# EAGLE design picusb (EAGLE 6.5.0)
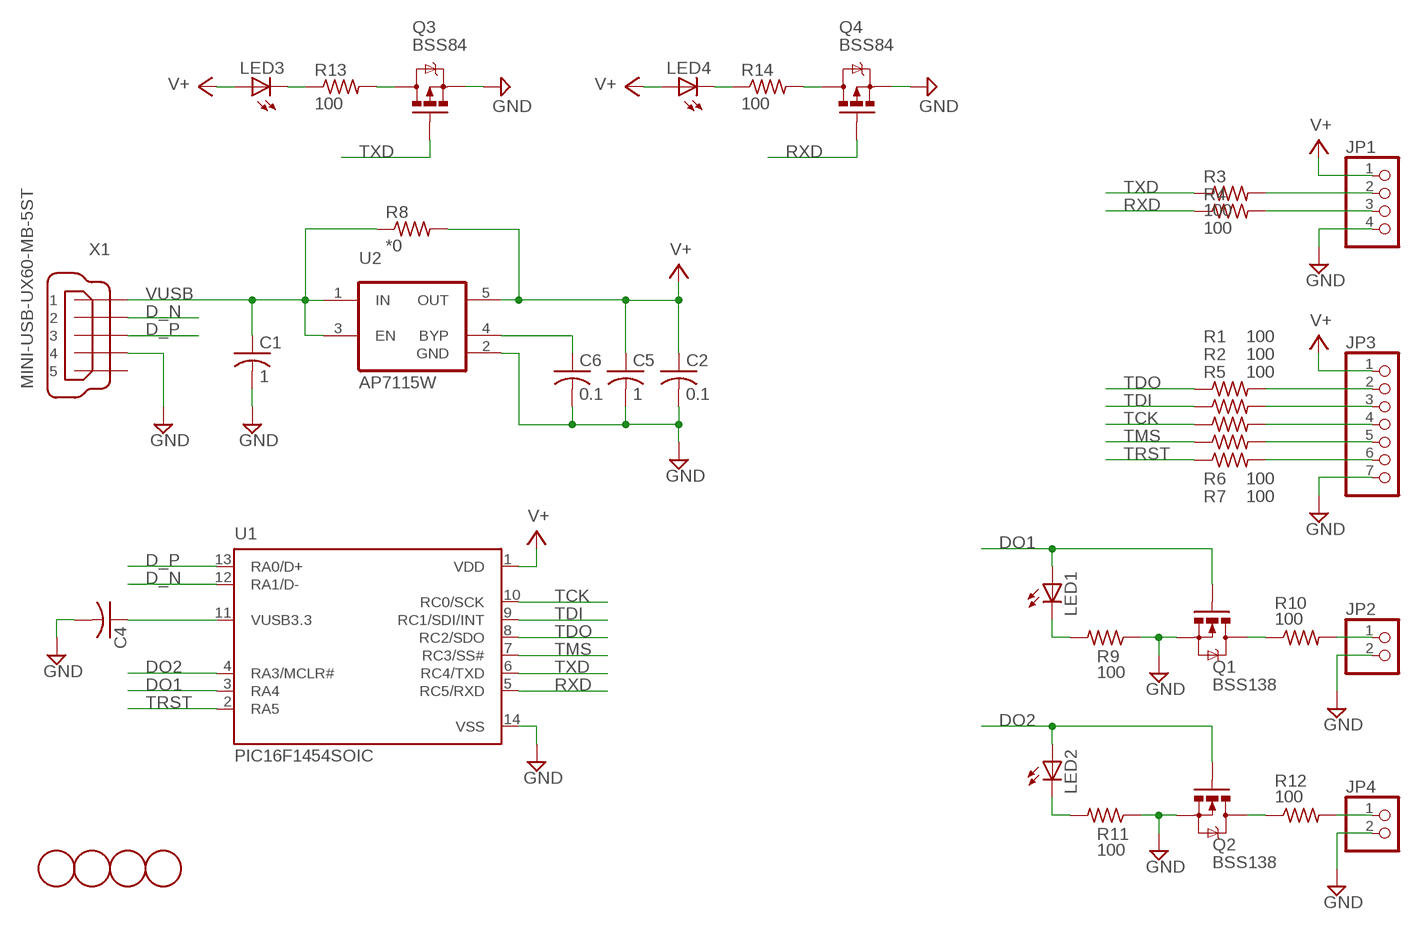
[diagram p0: schematic, sheet 1]

## Parts
C1  1  C-USC0805  [C0805]
C2  0.1  C-USC0805  [C0805]
C4  C-USC0805  [C0805]
C5  1  C-USC0805  [C0805]
C6  0.1  C-USC0805  [C0805]
JP1  PINHD-1X4  [1X04]
JP2  PINHD-1X2  [1X02]
JP3  PINHD-1X7  [1X07]
JP4  PINHD-1X2  [1X02]
LED1  LEDCHIP-LED0805  [CHIP-LED0805]
LED2  LEDCHIP-LED0805  [CHIP-LED0805]
LED3  LEDCHIP-LED0805  [CHIP-LED0805]
LED4  LEDCHIP-LED0805  [CHIP-LED0805]
Q1  BSS138  MOSFET-NCHANNELSMD  [SOT23-3]
Q2  BSS138  MOSFET-NCHANNELSMD  [SOT23-3]
Q3  BSS84  MOSFET-PCHANNELSOT23  [SOT23]
Q4  BSS84  MOSFET-PCHANNELSOT23  [SOT23]
R1  100  R-US_R0805  [R0805]
R2  100  R-US_R0805  [R0805]
R3  100  R-US_R0805  [R0805]
R4  100  R-US_R0805  [R0805]
R5  100  R-US_R0805  [R0805]
R6  100  R-US_R0805  [R0805]
R7  100  R-US_R0805  [R0805]
R8  *0  R-US_R0805  [R0805]
R9  100  R-US_R0805  [R0805]
R10  100  R-US_R0805  [R0805]
R11  100  R-US_R0805  [R0805]
R12  100  R-US_R0805  [R0805]
R13  100  R-US_R0805  [R0805]
R14  100  R-US_R0805  [R0805]
U1  PIC16F1454SOIC  [SOIC14]
U2  AP7115W  [SOT25]
U$1  MOUNTING_HOLENO_4  [HOLE_MTG_NO4]
U$2  MOUNTING_HOLENO_4  [HOLE_MTG_NO4]
U$3  MOUNTING_HOLENO_4  [HOLE_MTG_NO4]
U$4  MOUNTING_HOLENO_4  [HOLE_MTG_NO4]
X1  MINI-USB-UX60-MB-5ST  [UX60-MB-5ST]

## Nets
D_N: U1.12(RA1/D-) X1.2
D_P: U1.13(RA0/D+) X1.3
DO1: LED1.A Q1.1(G) U1.3(RA4)
DO2: LED2.A Q2.1(G) U1.4(RA3/MCLR#)
GND: C1.2 C2.2 C4.2 C5.2 C6.2 JP1.4 JP2.2 JP3.7 JP4.2 Q1.2(S) Q2.2(S) Q3.2(S) Q4.2(S) R9.1 R11.1 U1.14(VSS) U2.2(GND) X1.4
N$1: JP2.1 R10.2
N$2: C6.1 U2.4(BYP)
N$3: JP3.2 R1.2
N$4: C4.1 U1.11(VUSB3.3)
N$5: JP1.2 R3.2
N$6: JP1.3 R4.2
N$7: JP3.3 R2.2
N$8: LED1.C R9.2
N$9: JP3.4 R5.2
N$10: JP3.5 R6.2
N$11: JP3.6 R7.2
N$12: JP4.1 R12.2
N$13: Q1.3(D) R10.1
N$14: LED3.C R13.1
N$15: Q2.3(D) R12.1
N$16: Q3.3(D) R13.2
N$17: LED2.C R11.2
N$18: LED4.C R14.1
N$19: Q4.3(D) R14.2
RXD: Q4.1(G) R4.1 U1.5(RC5/RXD)
TCK: R5.1 U1.10(RC0/SCK)
TDI: R2.1 U1.9(RC1/SDI/INT)
TDO: R1.1 U1.8(RC2/SDO)
TMS: R6.1 U1.7(RC3/SS#)
TRST: R7.1 U1.2(RA5)
TXD: Q3.1(G) R3.1 U1.6(RC4/TXD)
V+: C2.1 C5.1 JP1.1 JP3.1 LED3.A LED4.A R8.2 U1.1(VDD) U2.5(OUT)
VUSB: C1.1 R8.1 U2.1(IN) U2.3(EN) X1.1
Unconnected: X1.5

## Library data of the parts
C1 C2 C4-C6 = rcl:C-US: CAPACITOR, American symbol
JP1 = pinhead:PINHD-1X4: PIN HEADER
JP2 JP4 = pinhead:PINHD-1X2: PIN HEADER
JP3 = pinhead:PINHD-1X7: PIN HEADER
LED1-LED4 = led:LED: LED OSRAM: - CHIPLED LG R971, LG N971, LY N971, LG Q971, LY Q971, LO R971, LY R971 LH N974, LH R974 LS Q976, LO Q976, LY Q976 LO Q996 - Hyper CHIPLED LW Q18S LB Q993, LB Q99A, LB R99A - SideLED LS A670, LO A670, LY A670, LG A670, LP A670 LB A673, LV A673, LT A673, LW A673 LH A674 LY A675 LS A676, LA A676, LO A676, LY A676, LW A676 LS A679, LY A679, LG A679 - Hyper Micro SIDELED® LS Y876, LA Y876, LO Y876, LY Y876 LT Y87S - SmartLED LW L88C, LW L88S LB L89C, LB L89S, LG L890 LS L89K, LO L89K, LY L89K LS L896, LA L896, LO L896, LY L896 - TOPLED LS T670, LO T670, LY T670, LG T670, LP T670 LSG T670, LSP T670, LSY T670, LOP T670, LYG T670 LG T671, LOG T671, LSG T671 LB T673, LV T673, LT T673, LW T673 LH T674 LS T676, LA T676, LO T676, LY T676, LB T676, LH T676, LSB T676, LW T676 LB T67C, LV T67C, LT T67C, LS T67K, LO T67K, LY T67K, LW E67C LS E67B, LA E67B, LO E67B, LY E67B, LB E67C, LV E67C, LT E67C LW T67C LS T679, LY T679, LG T679 LS T770, LO T770, LY T770, LG T770, LP T770 LB T773, LV T773, LT T773, LW T773 LH T774 LS E675, LA E675, LY E675, LS T675 LS T776, LA T776, LO T776, LY T776, LB T776 LHGB T686 LT T68C, LB T68C - Hyper Mini TOPLED® LB M676 - Mini TOPLED Santana® LG M470 LS M47K, LO M47K, LY M47K Source: http://www.osram.convergy.de LUXEON: - LUMILED® LXK2-PW12-R00, LXK2-PW12-S00, LXK2-PW14-U00, LXK2-PW14-V00 LXK2-PM12-R00, LXK2-PM12-S00, LXK2-PM14-U00 LXK2-PE12-Q00, LXK2-PE12-R00, LXK2-PE12-S00, LXK2-PE14-T00, LXK2-PE14-U00 LXK2-PB12-K00, LXK2-PB12-L00, LXK2-PB12-M00, LXK2-PB14-N00, LXK2-PB14-P00, LXK2-PB14-Q00 LXK2-PR12-L00, LXK2-PR12-M00, LXK2-PR14-Q00, LXK2-PR14-R00 LXK2-PD12-Q00, LXK2-PD12-R00, LXK2-PD12-S00 LXK2-PH12-R00, LXK2-PH12-S00 LXK2-PL12-P00, LXK2-PL12-Q00, LXK2-PL12-R00 Source: www.luxeon.com KINGBRIGHT: KA-3528ASYC Source: www.kingbright.com
Q1 Q2 = SparkFun:MOSFET-NCHANNEL
Q3 Q4 = SparkFun:MOSFET-PCHANNEL
R1-R14 = rcl:R-US_: RESISTOR, American symbol
U1 = microcontroller:PIC16F1454
U2 = ak-misc:AP7115
U$1-U$4 = ak-misc:MOUNTING_HOLE
X1 = con-hirose:MINI-USB-: MINI USB Connector Source: http://www.hirose.co.jp/cataloge_hp/e24000019.pdf; OC_FARNELL: unknown; OC_NEWARK: unknown

## Board
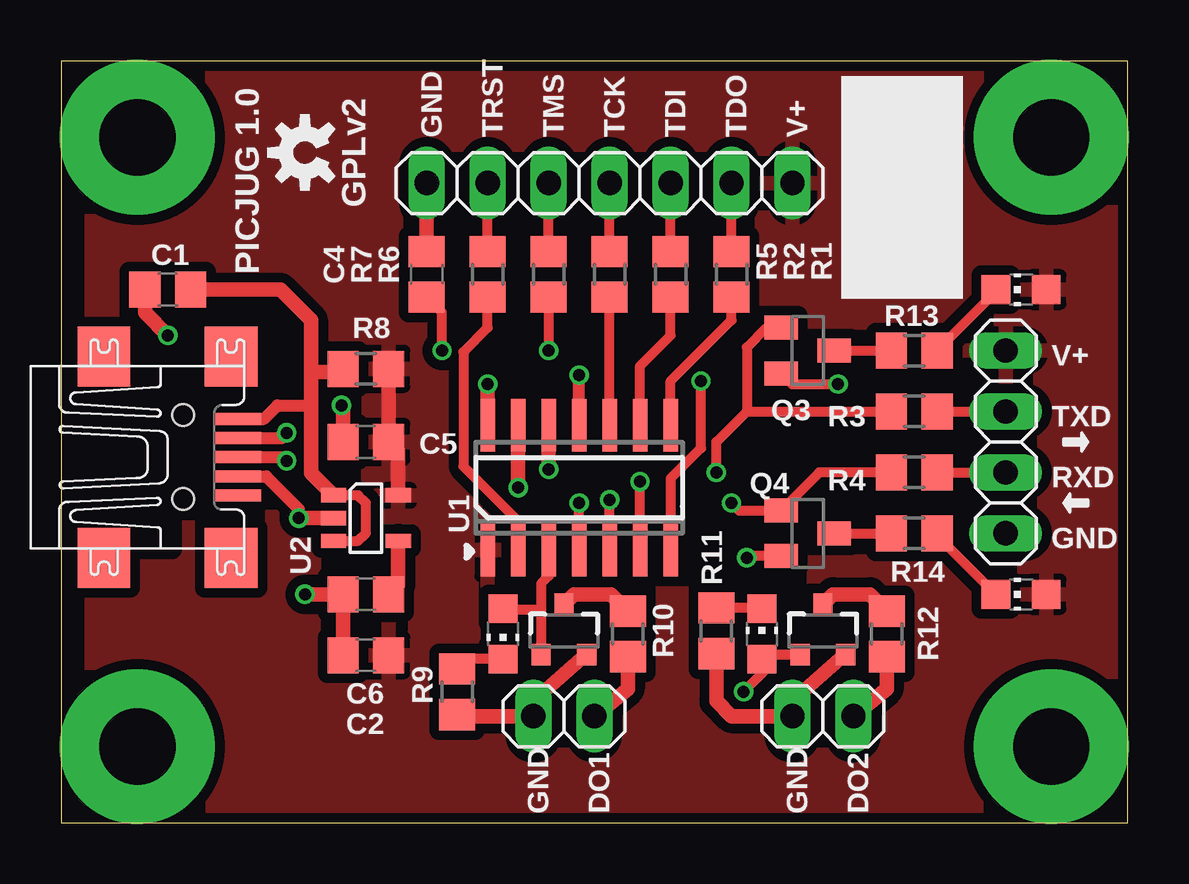
[diagram p1: board, top side]
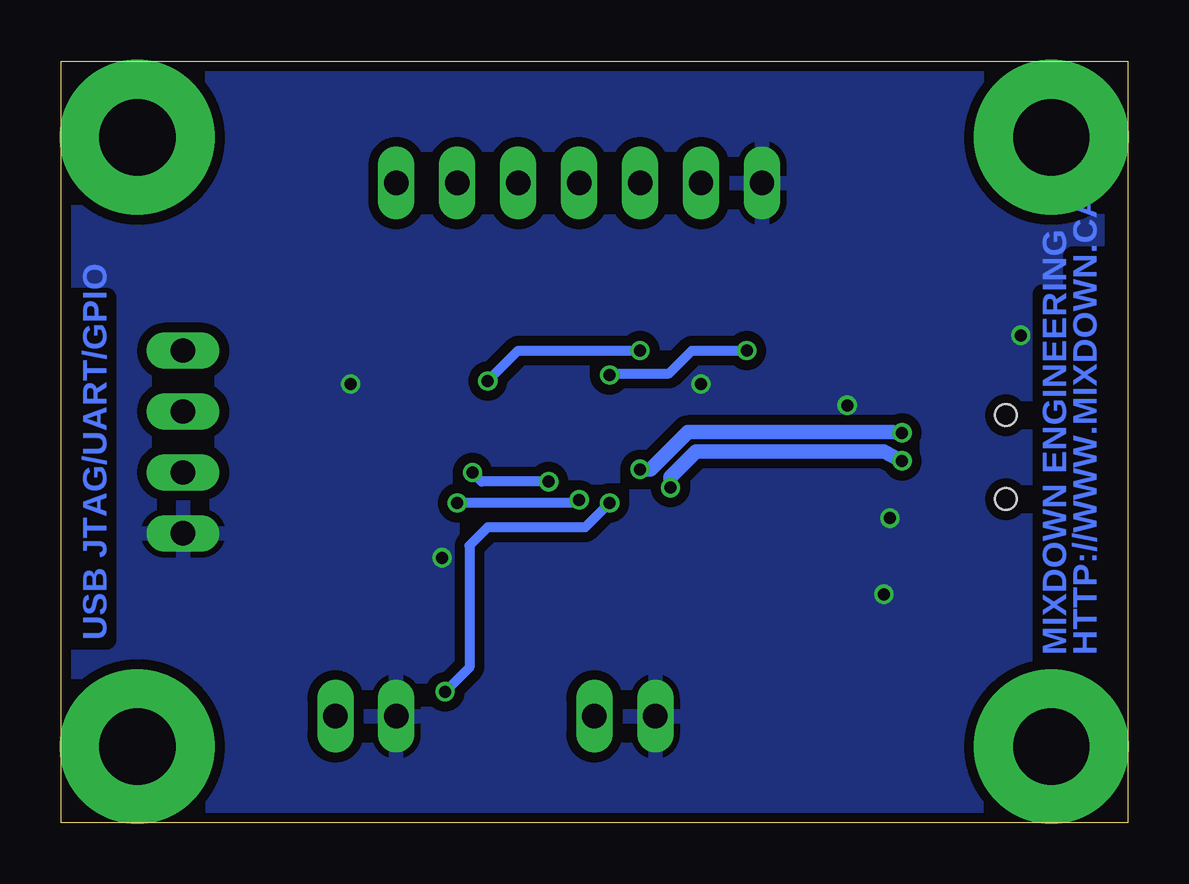
[diagram p2: board, bottom side, seen from below]

Size 44.45 x 31.75 mm. Coordinates in mm from the lower left corner, seen from the top.
Outline: 0,0 44.45,0 44.45,31.75 0,31.75 0,0
Copper layers (1*16): Top 0.035mm / dielectric 1.5mm / Bottom 0.035mm
Design rules "hackvana": minimum track width 6mil, minimum drill 0.3mm, track to track 6mil, track to pad 6mil, pad to pad 6mil, via to via 6mil, smd to smd 0mil, copper to edge 6mil, drill to drill 6mil, minimum pad ring 10mil, minimum via ring 6mil, stop-mask expansion 2mil, vias tented up to drill 100mil, thermal gap 10mil

### Footprints (pad centres in the part's own frame; a part is rotated, then mirrored left to right if it is on the bottom)
C0805 = smd 1.3 x 1.5: 1 -0.95,0; 2 0.95,0
1X04 = drill 1.016 long: 1 -3.81,0; 2 -1.27,0; 3 1.27,0; 4 3.81,0
1X02 = drill 1.016 long: 1 -1.27,0; 2 1.27,0
1X07 = drill 1.016 long: 1 -7.62,0; 2 -5.08,0; 3 -2.54,0; 4 0,0; 5 2.54,0; 6 5.08,0; 7 7.62,0
CHIP-LED0805 = smd 1.2 x 1.2: A 0,-1.05; C 0,1.05
SOT23-3 = smd 0.8 x 0.9: 1 -0.95,-1; 2 0.95,-1; 3 0,1.1
SOT23 = smd 1 x 1.4: 1 -0.95,-1.1; 2 0.95,-1.1; 3 0,1.1
R0805 = smd 1.3 x 1.5: 1 -0.95,0; 2 0.95,0
SOIC14 = smd 0.6 x 2.2: 1 -3.81,-2.6; 2 -2.54,-2.6; 3 -1.27,-2.6; 4 0,-2.6; 5 1.27,-2.6; 6 2.54,-2.6; 7 3.81,-2.6; 8 3.81,2.6; 9 2.54,2.6; 10 1.27,2.6; 11 0,2.6; 12 -1.27,2.6; 13 -2.54,2.6; 14 -3.81,2.6
SOT25 = smd 0.6 x 1.05: 1 -0.95,-1.35; 2 0,-1.35; 3 0.95,-1.35; 4 0.95,1.35; 5 -0.95,1.35
HOLE_MTG_NO4 = drill 3.175 pad 6.452: P$1 0,0
UX60-MB-5ST = smd 2 x 0.5: 1 2.25,1.6; 2 2.25,0.8; 3 2.25,0; 4 2.25,-0.8; 5 2.25,-1.6 | smd 2.2 x 2.5: M1 -3.3,-4.2; M2 -3.3,4.2; M3 2,4.2; M4 2,-4.2 | hole 0.9: 0,-1.75; 0,1.75

### Placement (x,y rotation side)
C1  4.45,22.23 180 top
C2  12.7,6.99 180 top
C4  15.24,22.86 90 top
C5  12.7,15.88 180 top
C6  12.7,9.53 180 top
JP1  39.37,15.88 270 top
JP2  20.95,4.45 180 top
JP3  22.86,26.67 180 top
JP4  31.75,4.45 180 top
LED1  18.41,7.87 180 top
LED2  29.21,7.87 0 top
LED3  40.01,22.23 90 top
LED4  40.01,9.53 90 top
Q1  20.95,8 0 top
Q2  31.75,8 0 top
Q3  31.11,19.68 270 top
Q4  31.11,12.06 270 top
R1  27.94,22.86 90 top
R2  25.4,22.86 90 top
R3  35.56,17.14 0 top
R4  35.56,14.61 0 top
R5  22.86,22.86 90 top
R6  20.32,22.86 90 top
R7  17.78,22.86 90 top
R8  12.7,18.92 0 top
R9  16.51,5.46 90 top
R10  23.62,7.87 270 top
R11  27.3,8 90 top
R12  34.42,7.87 270 top
R13  35.56,19.68 180 top
R14  35.56,12.06 180 top
U1  21.59,13.97 0 top
U2  12.7,12.7 270 top
U$1  3.17,3.17 0 top
U$2  41.27,3.17 0 top
U$3  3.17,28.57 0 top
U$4  41.27,28.57 0 top
X1  5.08,15.24 0 top

### Tracks (layer width: path | path; a pad name or v marks a point on that pad's centre or on a via)
D_N  (via drill 0.5)
  Top 0.508: X1.2 9.18,16.04 v9.4,16.26
  Top 0.61: U1.12 v20.32,14.73
  Bottom 0.61: v9.4,16.26 9.78,16.28 18.33,16.28 19.88,14.73 v20.32,14.73
D_P  (via drill 0.5)
  Top 0.508: X1.3 9.27,15.24 v9.4,15.09
  Top 0.61: U1.13 v19.05,13.97
  Bottom 0.61: v9.4,15.09 10.16,15.47 17.99,15.47 19.05,14.41 v19.05,13.97
DO1
  Top 0.406: U1.3 20.32,10.29 20,9.97 20,8.89 | 20,8.89 Q1.1 | 20,8.89 18.68,8.89 18.68,8.92 LED1.A
DO2  (via drill 0.5)
  Top 0.406: Q2.1 29.72,7 | 29.72,7 29.33,7 29.33,6.35 v28.45,5.46 | U1.4 v21.59,13.34 | LED2.A 29.54,6.82 29.72,7
  Bottom 0.406: v21.59,13.34 22.61,12.32 26.67,12.32 27.43,11.56 27.43,6.48 v28.45,5.46
GND  (via drill 0.5)
  Top 0.406: Q3.2 30.46,18.29 v32.38,18.29 | Q4.2 28.64,11.12 v28.57,11.05
  Top 0.508: X1.4 8.55,14.44 9.91,13.08 v9.91,12.7
  Top 0.61: U1.14 v17.78,18.29 | v10.16,9.53 C6.2 C2.2 | U2.2 v9.91,12.7 | C5.2 11.75,17.33 v11.68,17.4 | Q1.2 21.86,7 19.68,5.08 JP2.2 16.58,4.45 R9.1 | R11.1 27.3,5.08 27.94,4.45 JP4.2 30.48,5.08 32.66,7 Q2.2 | C4.2 JP3.7 | C1.2 3.5,21.27 v4.45,20.32
  pour Bottom (isolate 0.406): 1.27,0.64 1.27,31.11 43.81,31.11 43.81,0.64
N$1
  Top 0.61: R10.2 23.62,5.59 JP2.1
N$2
  Top 0.61: U2.4 14.05,9.93 C6.1
N$3
  Top 0.406: R1.2 JP3.2
N$4  (via drill 0.5)
  Top 0.406: v15.88,19.68 15.88,21.27 C4.1
  Top 0.508: U1.11 v21.59,18.67
  Bottom 0.406: v15.88,19.68 18.16,19.68 19.11,18.73 21.53,18.73 v21.59,18.67
N$5
  Top 0.406: R3.2 JP1.2
N$6
  Top 0.406: R4.2 JP1.3
N$7
  Top 0.406: R2.2 JP3.3
N$8
  Top 0.406: LED1.C 16.51,6.82 R9.2
N$9
  Top 0.406: R5.2 JP3.4
N$10
  Top 0.406: R6.2 JP3.5
N$11
  Top 0.406: R7.2 JP3.6
N$12
  Top 0.61: R12.2 34.42,5.59 JP4.1
N$13
  Top 0.61: Q1.3 21.38,9.53 22.92,9.53 R10.1
N$14
  Top 0.406: R13.1 39.05,22.23 LED3.C
N$15
  Top 0.61: Q2.3 32.17,9.53 33.72,9.53 R12.1
N$16
  Top 0.406: Q3.3 R13.2
N$17
  Top 0.406: R11.2 28.88,8.95 28.88,8.92 LED2.C
N$18
  Top 0.406: R14.1 36.72,12.06 36.72,11.77 LED4.C
N$19
  Top 0.406: Q4.3 R14.2
RXD  (via drill 0.5)
  Top 0.406: U1.5 v22.86,13.46 | R4.1 31.61,14.61 Q4.1 28.26,13.02 v27.94,13.34
  Bottom 0.406: v22.86,13.46 22.99,13.34 v27.94,13.34
TCK
  Top 0.406: U1.10 R5.1
TDI
  Top 0.406: U1.9 24.13,19.05 25.4,20.32 R2.1
TDO
  Top 0.406: R1.1 27.94,20.95 25.4,18.41 U1.8
TMS  (via drill 0.5)
  Top 0.406: R6.1 v20.32,19.68 | U1.7 25.4,14.35 26.67,15.62 v26.67,18.41
  Bottom 0.406: v26.67,18.41 25.4,19.68 v20.32,19.68
TRST
  Top 0.406: U1.2 19.05,12.57 16.76,14.86 16.76,19.62 17.78,20.64 R7.1
TXD  (via drill 0.5)
  Top 0.406: U1.6 v24.13,14.22 | v27.3,14.61 27.3,15.88 28.57,17.14 | 28.57,17.14 R3.1 | 28.57,17.14 28.57,19.81 29.4,20.64 Q3.1
  Bottom 0.406: v24.13,14.22 26.92,14.22 v27.3,14.61
V+
  Top 0.61: U2.5 14.05,15.47 C5.1 R8.2
  pour Top (isolate 0.406): 1.27,0.64 1.27,31.11 43.81,31.11 43.81,0.64
VUSB
  Top 0.406: U2.3 12.38,11.75 12.7,12.06 12.7,13.34 12.38,13.65 U2.1
  Top 0.508: X1.1 8.46,16.84 9.02,17.4 10.41,17.4
  Top 0.61: U2.1 10.41,14.59 10.41,17.4 10.41,18.8 | R8.1 11.43,18.92 11.3,18.8 10.41,18.8 | C1.1 9.14,22.23 10.41,20.95 10.41,18.8

### Text on the board
Bottom: USB JTAG/UART/GPIO | HTTP://WWW.MIXDOWN.CA | MIXDOWN ENGINEERING
tPlace: GND | TRST | TMS | TCK | TDI | TDO | V+ | GPLv2 | PICJUG 1.0 | V+ | TXD | RXD | GND | GND | DO1 | GND | DO2